# EAGLE schematic P1001-00X-Bus Display (EAGLE 9.4.2)
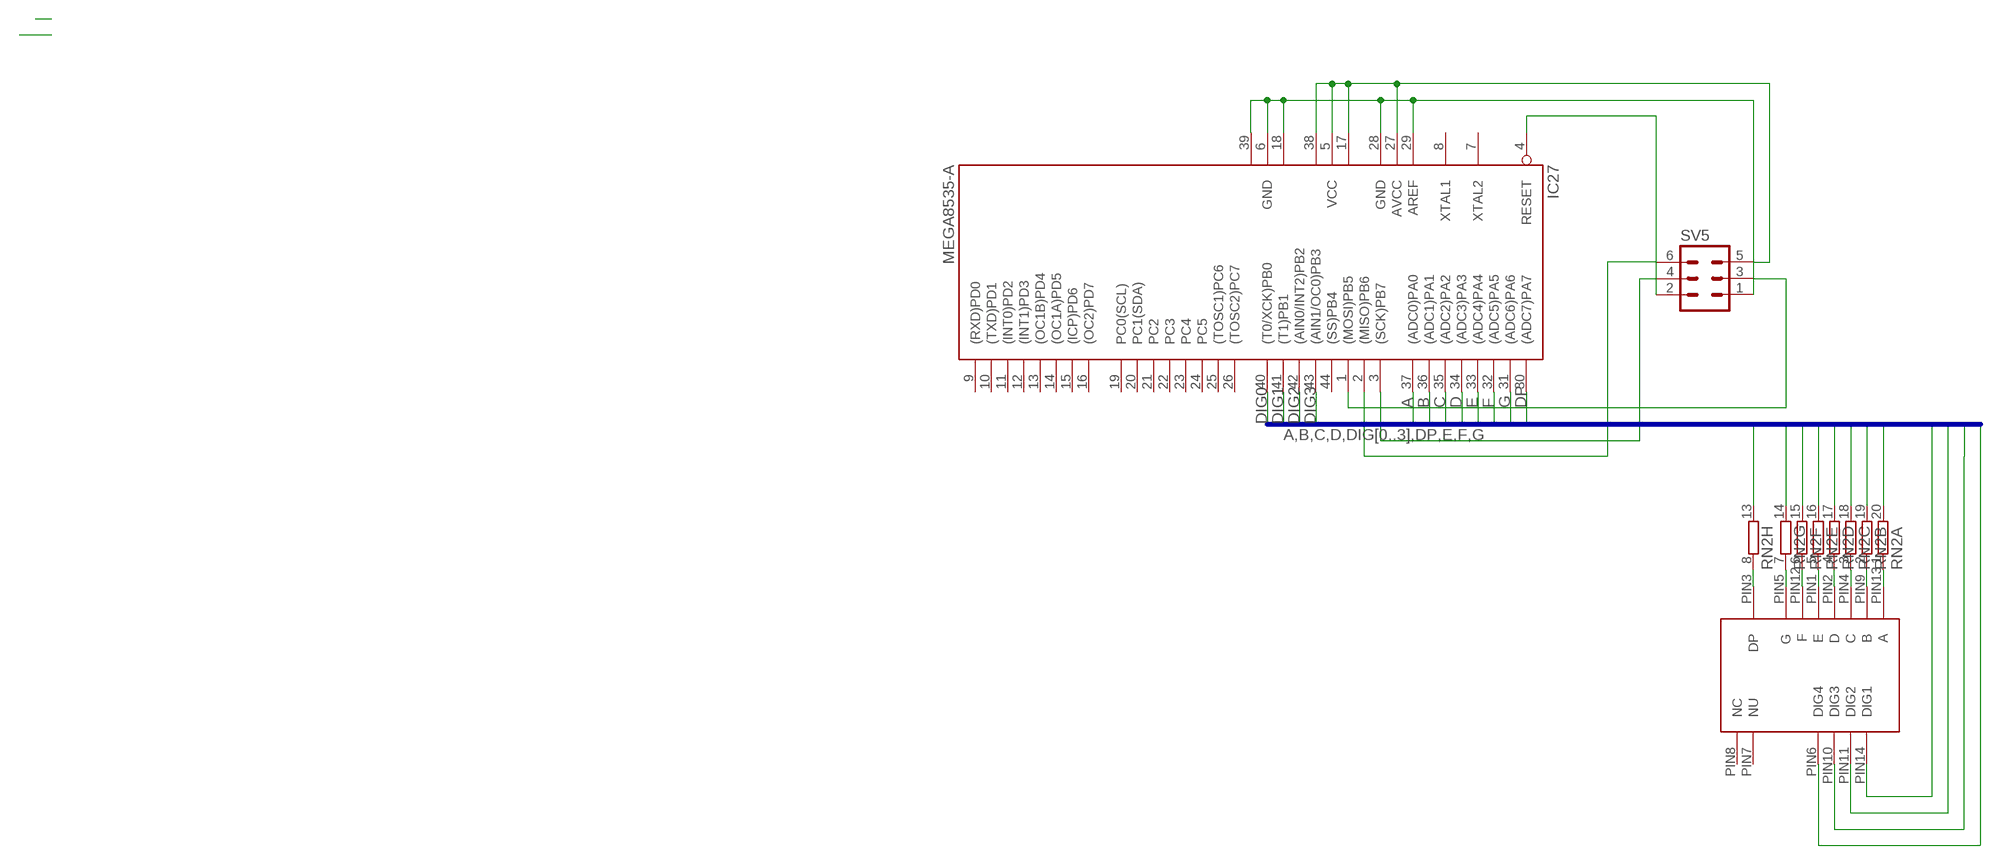
[diagram p0: schematic, sheet 1]

## Parts
IC27  MEGA8535-A  [TQFP44]
RN2  10R-NSOMC  [SOMC20]
SV5  ML6  [ML6]
U$1  4-DIGIT-7-SEGMENT  [4-DIGIT-7-SEGMENT]

## Nets
A: IC27.37((ADC0)PA0) RN2.20
B: IC27.36((ADC1)PA1) RN2.19
C: IC27.35((ADC2)PA2) RN2.18
D: IC27.34((ADC3)PA3) RN2.17
DIG0: IC27.40((T0/XCK)PB0) U$1.PIN14(DIG1)
DIG1: IC27.41((T1)PB1) U$1.PIN11(DIG2)
DIG2: IC27.42((AIN0/INT2)PB2) U$1.PIN10(DIG3)
DIG3: IC27.43((AIN1/OC0)PB3) U$1.PIN6(DIG4)
DP: IC27.30((ADC7)PA7) RN2.13
E: IC27.33((ADC4)PA4) RN2.16
F: IC27.32((ADC5)PA5) RN2.15
G: IC27.31((ADC6)PA6) RN2.14
N$1: IC27.5(VCC) IC27.17(VCC1) IC27.27(AVCC) IC27.38(VCC2) SV5.5
N$2: IC27.6(GND) IC27.18(GND1) IC27.28(GND) IC27.29(AREF) IC27.39(GND2) SV5.1
N$18: IC27.1((MOSI)PB5) SV5.3
N$19: IC27.3((SCK)PB7) SV5.4
N$20: IC27.2((MISO)PB6) SV5.6
N$21: IC27.4(RESET) SV5.2
N$24: RN2.1 U$1.PIN13(A)
N$25: RN2.2 U$1.PIN9(B)
N$26: RN2.3 U$1.PIN4(C)
N$27: RN2.4 U$1.PIN2(D)
N$28: RN2.5 U$1.PIN1(E)
N$29: RN2.6 U$1.PIN12(F)
N$30: RN2.7 U$1.PIN5(G)
N$31: RN2.8 U$1.PIN3(DP)
Unconnected: IC27.7(XTAL2) IC27.8(XTAL1) IC27.9((RXD)PD0) IC27.10((TXD)PD1) IC27.11((INT0)PD2) IC27.12((INT1)PD3) IC27.13((OC1B)PD4) IC27.14((OC1A)PD5) IC27.15((ICP)PD6) IC27.16((OC2)PD7) IC27.19(PC0(SCL)) IC27.20(PC1(SDA)) IC27.21(PC2) IC27.22(PC3) IC27.23(PC4) IC27.24(PC5) IC27.25((TOSC1)PC6) IC27.26((TOSC2)PC7) IC27.44((SS)PB4) RN2.9 RN2.10 RN2.11 RN2.12 U$1.PIN7(NU) U$1.PIN8(NC)

## Buses
A,B,C,D,DIG[0..3],DP,E,F,G

## Library data of the parts
IC27 = atmel:MEGA8535: MICROCONTROLLER 8 Kbytes FLASH 512 bytes SRAM 512 bytes EEPROM USART 8-channel 10 bit ADC Source: avr.lbr; MPN: ATMEGA8535-16AU; OC_FARNELL: 1528437; OC_NEWARK: 01M6908
RN2 = resistor-dil:10R-N: DIL RESISTOR; OC_FARNELL: unknown; OC_NEWARK: unknown
SV5 = con-harting-ml:ML6: HARTING; OC_FARNELL: unknown; OC_NEWARK: unknown
U$1 = ADAFRUIT:4-DIGIT-7-SEGMENT

## Net classes
2 power: width 0.457 mm